# Altium project TableTennisX2.PrjPcb
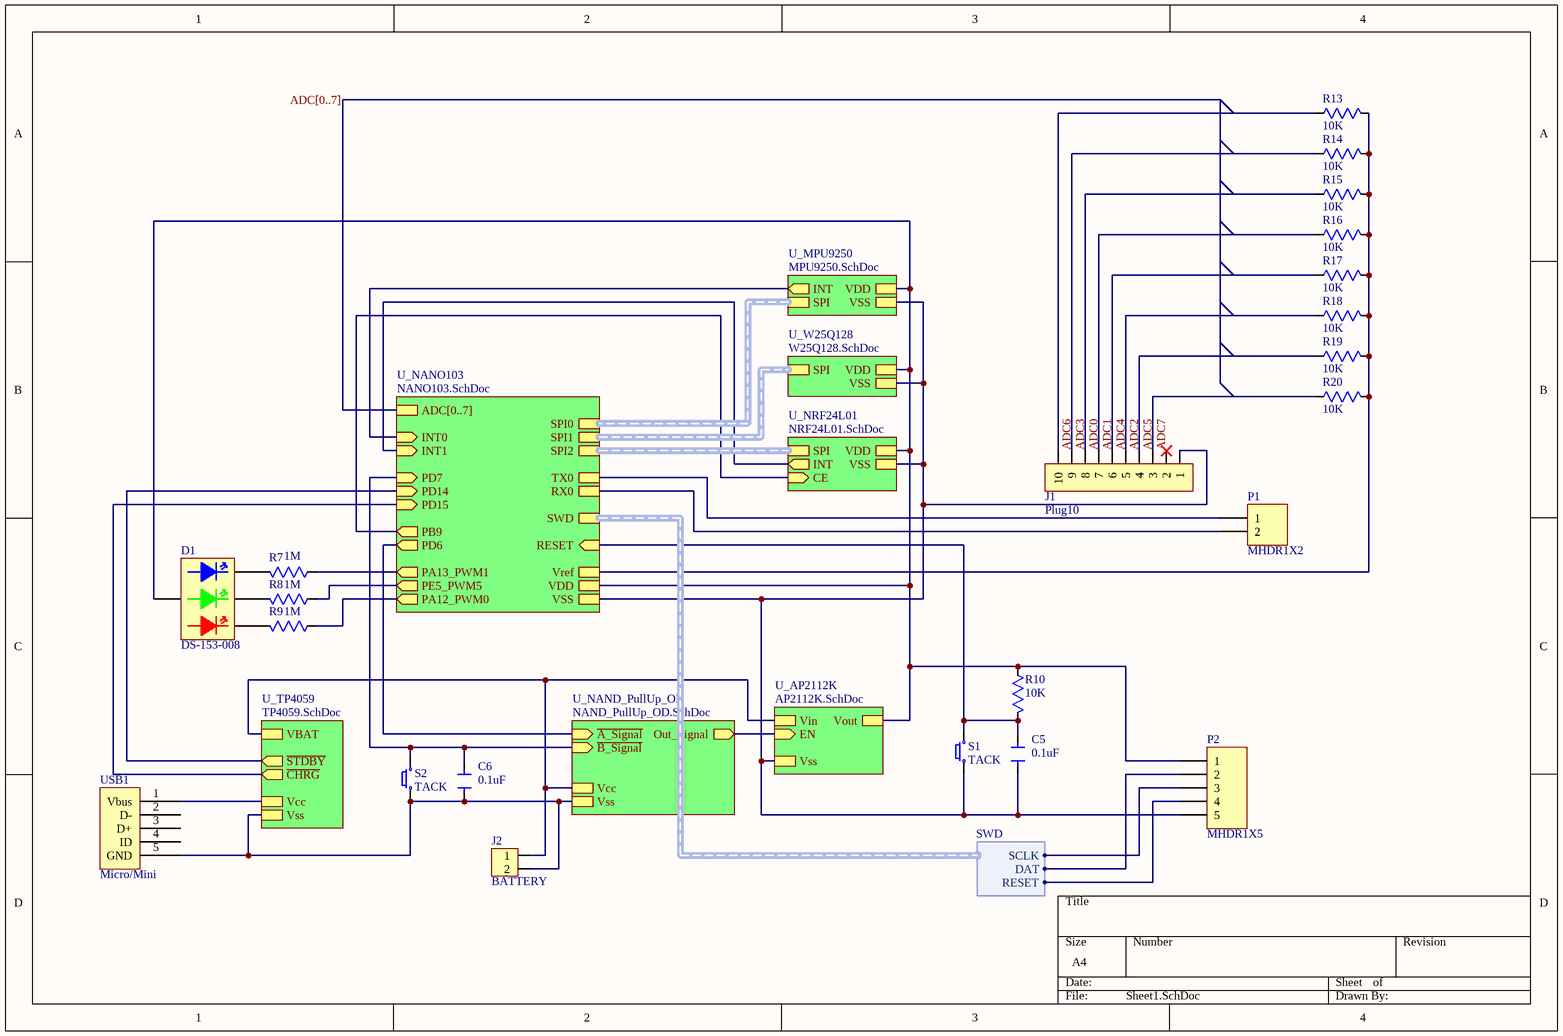
[diagram p0: Sheet1.SchDoc]
8 sheets, 62 parts. Net scope: hierarchical (ports join the sheet entries above them; power ports are global).
Sheets:
  Sheet1.SchDoc
    U_AP2112K = AP2112K.SchDoc
    U_NAND_PullUp_OD = NAND_PullUp_OD.SchDoc
    U_TP4059 = TP4059.SchDoc
    U_MPU9250 = MPU9250.SchDoc
    U_NANO103 = NANO103.SchDoc
    U_W25Q128 = W25Q128.SchDoc
    U_NRF24L01 = NRF24L01.SchDoc

## Sheet Sheet1.SchDoc
size A4

### Parts
C5  value 0.1uF  [CAP_0402]  (hidden comment: Cap)
C6  value 0.1uF  [CAP_0402]  (hidden comment: Cap)
D1  DS-153-008  [LED_RGB_0603]
J1  Plug10  [FPC0.5-10PS]
J2  BATTERY  [Terminal_block_2pin_1.25mm_SMD]
P1  MHDR1X2  [MHDR1X2]
P2  MHDR1X5  [MHDR1X5]
R7  value 1M  [RES_0402]  (hidden comment: Res)
R8  value 1M  [RES_0402]  (hidden comment: Res)
R9  value 1M  [RES_0402]  (hidden comment: Res)
R10  value 10K  [RES_0402]  (hidden comment: Res)
R13  value 10K  [RES_0402]  (hidden comment: Res)
R14  value 10K  [RES_0402]  (hidden comment: Res)
R15  value 10K  [RES_0402]  (hidden comment: Res)
R16  value 10K  [RES_0402]  (hidden comment: Res)
R17  value 10K  [RES_0402]  (hidden comment: Res)
R18  value 10K  [RES_0402]  (hidden comment: Res)
R19  value 10K  [RES_0402]  (hidden comment: Res)
R20  value 10K  [RES_0402]  (hidden comment: Res)
S1  TACK  [TACK-SW_SMD 2P 4x3mm_2]
S2  TACK  [TACK-SW_SMD 2P 4x3mm_2]
USB1  Micro/Mini  [USB_Micro-B_S_SMT]

### Sub-sheets
U_AP2112K = AP2112K.SchDoc: EN (in), Vin, Vout, Vss
U_MPU9250 = MPU9250.SchDoc: SPI (harness SPI), VDD, VSS, INT (out)
U_NAND_PullUp_OD = NAND_PullUp_OD.SchDoc: ~{A_Signal} (in), Out_Signal (out), ~{B_Signal} (in), Vcc, Vss
U_NANO103 = NANO103.SchDoc: ADC[0..7], SPI0 (harness SPI), SPI1 (harness SPI), SPI2 (harness SPI), INT0 (in), INT1 (in), PD15 (in), PD14 (in), PD7 (in), TX0, RX0, SWD (harness SWD), VDD, VSS, PB9 (out), PD6 (out), PA12_PWM0 (out), PA13_PWM1 (out), PE5_PWM5 (out), Vref, RESET (in)
U_NRF24L01 = NRF24L01.SchDoc: VDD, VSS, INT (out), CE (in), SPI (harness SPI)
U_TP4059 = TP4059.SchDoc: ~{CHRG} (out), ~{STDBY} (out), Vss, Vcc, VBAT
U_W25Q128 = W25Q128.SchDoc: SPI (harness SPI), VDD, VSS

### Harnesses
SWD: DAT, RESET, SCLK

### Nets
/RESET: C5.1 P2.4 R10.1 S1.1 ; sheet U_NANO103/RESET, sheet U_NANO103/SWD.RESET
ADC0: J1.8 R15.2
ADC1: J1.7 R16.2
ADC2: J1.5 R18.2
ADC3: J1.9 R14.2
ADC4: J1.6 R17.2
ADC5: J1.4 R19.2
ADC6: J1.10 R13.2
ADC7: J1.3 R20.2
CE: sheet U_NANO103/PB9, sheet U_NRF24L01/CE
ICE_CLK: P2.3 ; sheet U_NANO103/SWD.SCLK
ICE_DAT: P2.2 ; sheet U_NANO103/SWD.DAT
INT: sheet U_NANO103/INT1, sheet U_NRF24L01/INT
INT0: sheet U_MPU9250/INT, sheet U_NANO103/INT0
PA12_PWM0: R9.2 ; sheet U_NANO103/PA12_PWM0
PA13_PWM1: R7.2 ; sheet U_NANO103/PA13_PWM1
PD6: sheet U_NAND_PullUp_OD/~{A_Signal}, sheet U_NANO103/PD6
PD7: C6.1 S2.1 ; sheet U_NAND_PullUp_OD/~{B_Signal}, sheet U_NANO103/PD7
PD14: sheet U_TP4059/~{STDBY}, sheet U_NANO103/PD14
PD15: sheet U_TP4059/~{CHRG}, sheet U_NANO103/PD15
PE5_PWM5: R8.2 ; sheet U_NANO103/PE5_PWM5
RX0: P1.2 ; sheet U_NANO103/RX0
TX0: P1.1 ; sheet U_NANO103/TX0
V33: D1.3(Anode) P2.1 R10.2 ; sheet U_AP2112K/Vout, sheet U_MPU9250/VDD, sheet U_NANO103/VDD, sheet U_W25Q128/VDD, sheet U_NRF24L01/VDD
Vref: R13.1 R14.1 R15.1 R16.1 R17.1 R18.1 R19.1 R20.1 ; sheet U_NANO103/Vref
VSS: C5.2 J1.1 P2.5 S1.2 ; sheet U_AP2112K/Vss, sheet U_MPU9250/VSS, sheet U_NANO103/VSS, sheet U_W25Q128/VSS, sheet U_NRF24L01/VSS
NetC1_1: J2.1 ; sheet U_AP2112K/Vin, sheet U_NAND_PullUp_OD/Vcc, sheet U_TP4059/VBAT
NetC3_2: C6.2 J2.2 S2.2 USB1.5(GND) ; sheet U_NAND_PullUp_OD/Vss, sheet U_TP4059/Vss
NetD1_1: D1.1(G) R8.1
NetD1_2: D1.2(B) R7.1
NetD1_4: D1.4(R) R9.1
NetQ1_3: sheet U_AP2112K/EN, sheet U_NAND_PullUp_OD/Out_Signal
NetQ4_1: USB1.1(Vbus) ; sheet U_TP4059/Vcc

Not connected (* = marked no-connect by the designer): J1 2*; USB1 2(D-) 3(D+) 4(ID)

### Buses and harness runs
bus ADC[0..7] = sheet U_NANO103/ADC[0..7]
harness sheet U_MPU9250/SPI = sheet U_NANO103/SPI0
harness sheet U_NANO103/SPI1 = sheet U_W25Q128/SPI
harness sheet U_NANO103/SPI2 = sheet U_NRF24L01/SPI

### Library data of the parts
J2 = Plug2
P1 = MHDR1X2: Header, 2-Pin; LatestRevisionDate: 17-Jul-2002; LatestRevisionNote: Re-released for DXP Platform.; Publisher: Altium Limited
P2 = MHDR1X5: Header, 5-Pin; LatestRevisionDate: 17-Jul-2002; LatestRevisionNote: Re-released for DXP Platform.; Publisher: Altium Limited
S1 S2 = Switch_Button1
USB1 = USB2

## Sheet AP2112K.SchDoc
size A4
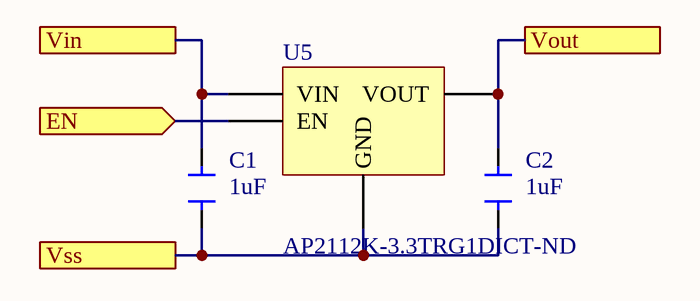
[diagram p1: AP2112K.SchDoc]

### Parts
C1  value 1uF  [CAP_0402]  (hidden comment: Cap)
C2  value 1uF  [CAP_0402]  (hidden comment: Cap)
U5  Supplier Part Number 1: AP2112K-3.3TRG1DICT-ND  [SOT23-5]  (hidden comment: AP2112K-3.3TRG1)

### Ports
EN (in), Vin, Vout, Vss

### Nets
V33: C2.1 U5.4(VOUT) ; port Vout
VSS: C1.2 C2.2 U5.3(GND) ; port Vss
NetC1_1: C1.1 U5.1(VIN) ; port Vin
NetQ1_3: U5.2(EN) ; port EN

### Library data of the parts
U5 = AP2112K-3.3TRG1: IC REG LINEAR 3.3V 600MA SOT23-5; pin to pad: 2>3 3>2 4>5; Manufacturer: Diodes; Number of Regulators: 1; Quiescent Current: 55uA; Polarity: Positive; Max Input Voltage: 6V; Min Input Voltage: 2.5V; Accuracy: 1.5%; Dropout Voltage: 250mV; Output Type: Fixed; Supplier 1: Digi-Key; Manufacturer Part Number: AP2112K-3.3TRG1; RoHS: Yes; Category: Voltage Regulators - Linear; Stock 1: 54786; Pricing 1: 1=0.47000, 10=0.35500, 25=0.32000, 100=0.17450, 250=0.16872, 500=0.15126, 1000=0.11636 (USD); Mount: Surface Mount; Case/Package: SOT-23-5; Number of Pins: 5; Min Operating Temperature: -40°C; Max Operating Temperature: 85°C; Output Current: 600mA; Max Output Current: 600mA; Output Voltage: 3.3V; Number of Outputs: 1; Package Quantity: 1; Packaging: Tape and Reel; Length: 3.1mm; Height: 1.3mm; Width: 1.7mm; Lead Free: Lead Free; ComponentLink1URL: https://datasheet.ciiva.com/29569/ap2112-29569919.pdf?src-supplier=Digi-Key; ComponentLink1Description: https://datasheet.ciiva.com/29569/ap2112-29569919.pdf?src-supplier=Digi-Key; ComponentLink2URL: https://datasheet.ciiva.com/30016/ap2112-30016792.pdf?src-supplier=Avnet; ComponentLink2Description: https://datasheet.ciiva.com/30016/ap2112-30016792.pdf?src-supplier=Avnet; ComponentLink3URL: https://datasheet.ciiva.com/29569/ap2112-29569917.pdf?src-supplier=Digi-Key; ComponentLink3Description: https://datasheet.ciiva.com/29569/ap2112-29569917.pdf?src-supplier=Digi-Key; ComponentLink4URL: https://datasheet.ciiva.com/29569/ap2112-29569918.pdf?src-supplier=Digi-Key; ComponentLink4Description: https://datasheet.ciiva.com/29569/ap2112-29569918.pdf?src-supplier=Digi-Key

## Sheet NAND_PullUp_OD.SchDoc
size A4
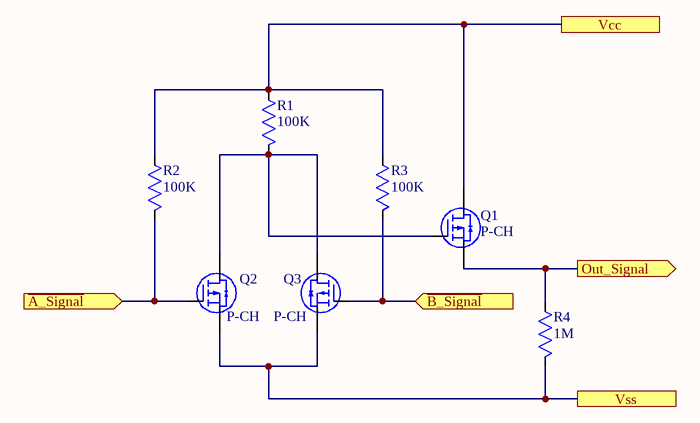
[diagram p2: NAND_PullUp_OD.SchDoc]

### Parts
Q1  Polarity: P-CH  [SOT-23]  (hidden comment: SI2301DS-T1)
Q2  Polarity: P-CH  [SOT-23]  (hidden comment: SI2301DS-T1)
Q3  Polarity: P-CH  [SOT-23]  (hidden comment: SI2301DS-T1)
R1  value 100K  [RES_0402]  (hidden comment: Res)
R2  value 100K  [RES_0402]  (hidden comment: Res)
R3  value 100K  [RES_0402]  (hidden comment: Res)
R4  value 1M  [RES_0402]  (hidden comment: Res)

### Ports
Out_Signal (out), Vcc, Vss, ~{A_Signal} (in), ~{B_Signal} (in)

### Nets
PD6: Q2.2 R2.1 ; port ~{A_Signal}
PD7: Q3.2 R3.1 ; port ~{B_Signal}
NetC1_1: Q1.1 R1.2 R2.2 R3.2 ; port Vcc
NetC3_2: Q2.3 Q3.3 R4.1 ; port Vss
NetQ1_2: Q1.2 Q2.1 Q3.1 R1.1
NetQ1_3: Q1.3 R4.2 ; port Out_Signal

### Library data of the parts
Q1-Q3 = SI2301DS-T1: Trans MOSFET P-CH 20V 2.3A 3-Pin TO-236 T/R; pin to pad: 1>2 2>1; Manufacturer: Vishay Siliconix; Rise Time: 36ns; Drain to Source Resistance: 130mR; Gate to Source Voltage (Vgs): 8V; Max Power Dissipation: 1.25W; Turn-Off Delay Time: 42ns; Turn-On Delay Time: 13ns; Number of Elements: 1; Element Configuration: Single; Drain to Source Voltage (Vdss): -20V; Supplier 1: Component Sense; Manufacturer Part Number: SI2301DS-T1; RoHS: No; Category: MOSFETs; Stock 1: 12531; Pricing 1: 143=0.17500, 500=0.15000, 1000=0.10000, 5000=0.09000, 10000=0.08000 (USD); Mount: Surface Mount; Case/Package: SOT-23-3; Number of Pins: 3; Weight: 0.050717oz; Min Operating Temperature: -55°C; Max Operating Temperature: 150°C; Packaging: Tape and Reel; Package Quantity: 3000; Continuous Drain Current (ID): 2.3A; Fall Time: 36ns; Power Dissipation: 1.25W; Number of Channels: 1; Length: 3.04mm; Height: 1.02mm; Width: 1.4mm; ComponentLink1URL: https://datasheet.ciiva.com/13048/70627-115154-13048148.pdf?src-supplier=Mouser; ComponentLink1Description: https://datasheet.ciiva.com/13048/70627-115154-13048148.pdf?src-supplier=Mouser; Supplier Part Number 1: SI2301DS-T1

## Sheet TP4059.SchDoc
size A4
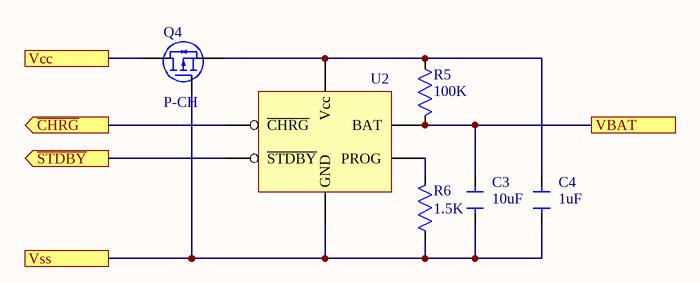
[diagram p3: TP4059.SchDoc]

### Parts
C3  value 10uF  [Cap_0603]  (hidden comment: Cap)
C4  value 1uF  [Cap_0603]  (hidden comment: Cap)
Q4  Polarity: P-CH  [SOT-23]  (hidden comment: SI2301DS-T1)
R5  value 100K  [RES_0402]  (hidden comment: Res)
R6  value 1.5K  [RES_0402]  (hidden comment: Res)
U2  TP4059  [SOT23-6]  (value not drawn)

### Ports
VBAT, Vcc, Vss, ~{CHRG} (out), ~{STDBY} (out)

### Nets
PD14: U2.3(~{STDBY}) ; port ~{STDBY}
PD15: U2.2(~{CHRG}) ; port ~{CHRG}
NetC1_1: C3.1 R5.1 U2.6(BAT) ; port VBAT
NetC3_2: C3.2 C4.2 Q4.2 R6.2 U2.4(GND) ; port Vss
NetC4_1: C4.1 Q4.3 R5.2 U2.1(Vcc)
NetQ4_1: Q4.1 ; port Vcc
NetR6_1: R6.1 U2.5(PROG)

### Library data of the parts
Q4 = SI2301DS-T1: Trans MOSFET P-CH 20V 2.3A 3-Pin TO-236 T/R; pin to pad: 1>2 2>1; Manufacturer: Vishay Siliconix; Rise Time: 36ns; Drain to Source Resistance: 130mR; Gate to Source Voltage (Vgs): 8V; Max Power Dissipation: 1.25W; Turn-Off Delay Time: 42ns; Turn-On Delay Time: 13ns; Number of Elements: 1; Element Configuration: Single; Drain to Source Voltage (Vdss): -20V; Supplier 1: Component Sense; Manufacturer Part Number: SI2301DS-T1; RoHS: No; Category: MOSFETs; Stock 1: 12531; Pricing 1: 143=0.17500, 500=0.15000, 1000=0.10000, 5000=0.09000, 10000=0.08000 (USD); Mount: Surface Mount; Case/Package: SOT-23-3; Number of Pins: 3; Weight: 0.050717oz; Min Operating Temperature: -55°C; Max Operating Temperature: 150°C; Packaging: Tape and Reel; Package Quantity: 3000; Continuous Drain Current (ID): 2.3A; Fall Time: 36ns; Power Dissipation: 1.25W; Number of Channels: 1; Length: 3.04mm; Height: 1.02mm; Width: 1.4mm; ComponentLink1URL: https://datasheet.ciiva.com/13048/70627-115154-13048148.pdf?src-supplier=Mouser; ComponentLink1Description: https://datasheet.ciiva.com/13048/70627-115154-13048148.pdf?src-supplier=Mouser; Supplier Part Number 1: SI2301DS-T1
U2 = TP4059: 600MA SOT23-6; pin to pad: 1>4 2>1 3>5 4>2 5>6 6>3; ComponentLink1Description: Datasheet; ComponentLink1URL: http://www.tp-asic.com/res/tp-asic/pdres/201403/TP4059.pdf

## Sheet MPU9250.SchDoc
size A4
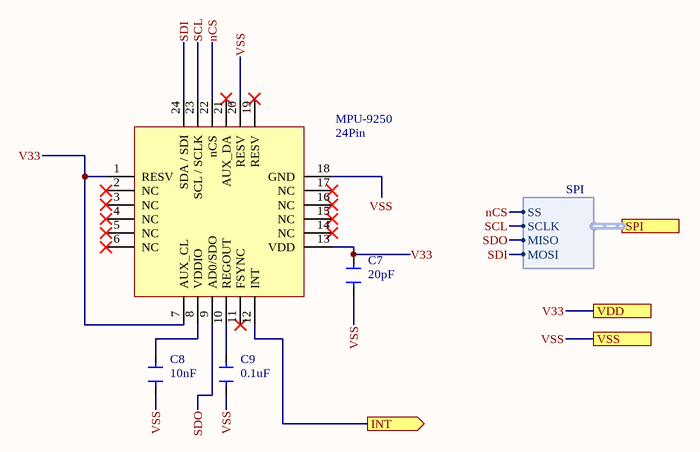
[diagram p4: MPU9250.SchDoc]

### Parts
C7  value 20pF  [CAP_0402]  (hidden comment: Cap)
C8  value 10nF  [CAP_0402]  (hidden comment: Cap)
C9  value 0.1uF  [CAP_0402]  (hidden comment: Cap)
MPU-9250  24Pin  [QFN_24PIN]

### Ports
INT (out), SPI (harness SPI), VDD, VSS

### Harnesses
SPI: SS, SCLK, MISO, MOSI

### Nets
INT0: MPU-9250.12(INT) ; port INT
nCS: MPU-9250.22(nCS) ; port SPI.SS
SCL: MPU-9250.23(SCL_/_SCLK) ; port SPI.SCLK
SDI: MPU-9250.24(SDA_/_SDI) ; port SPI.MOSI
SDO: MPU-9250.9(AD0/SDO) ; port SPI.MISO
V33: C7.1 MPU-9250.1(RESV) MPU-9250.7(AUX_CL) MPU-9250.13(VDD) ; port VDD
VSS: C7.2 C8.2 C9.2 MPU-9250.18(GND) MPU-9250.20(RESV) ; port VSS
NetC8_1: C8.1 MPU-9250.8(VDDIO)
NetC9_1: C9.1 MPU-9250.10(REGOUT)

Not connected (* = marked no-connect by the designer): MPU-9250 2(NC)* 3(NC)* 4(NC)* 5(NC)* 6(NC)* 11(FSYNC)* 14(NC)* 15(NC)* 16(NC)* 17(NC)* 19(RESV)* 21(AUX_DA)*

### Library data of the parts
MPU-9250 = MPU-9250_2

## Sheet NANO103.SchDoc
size A3
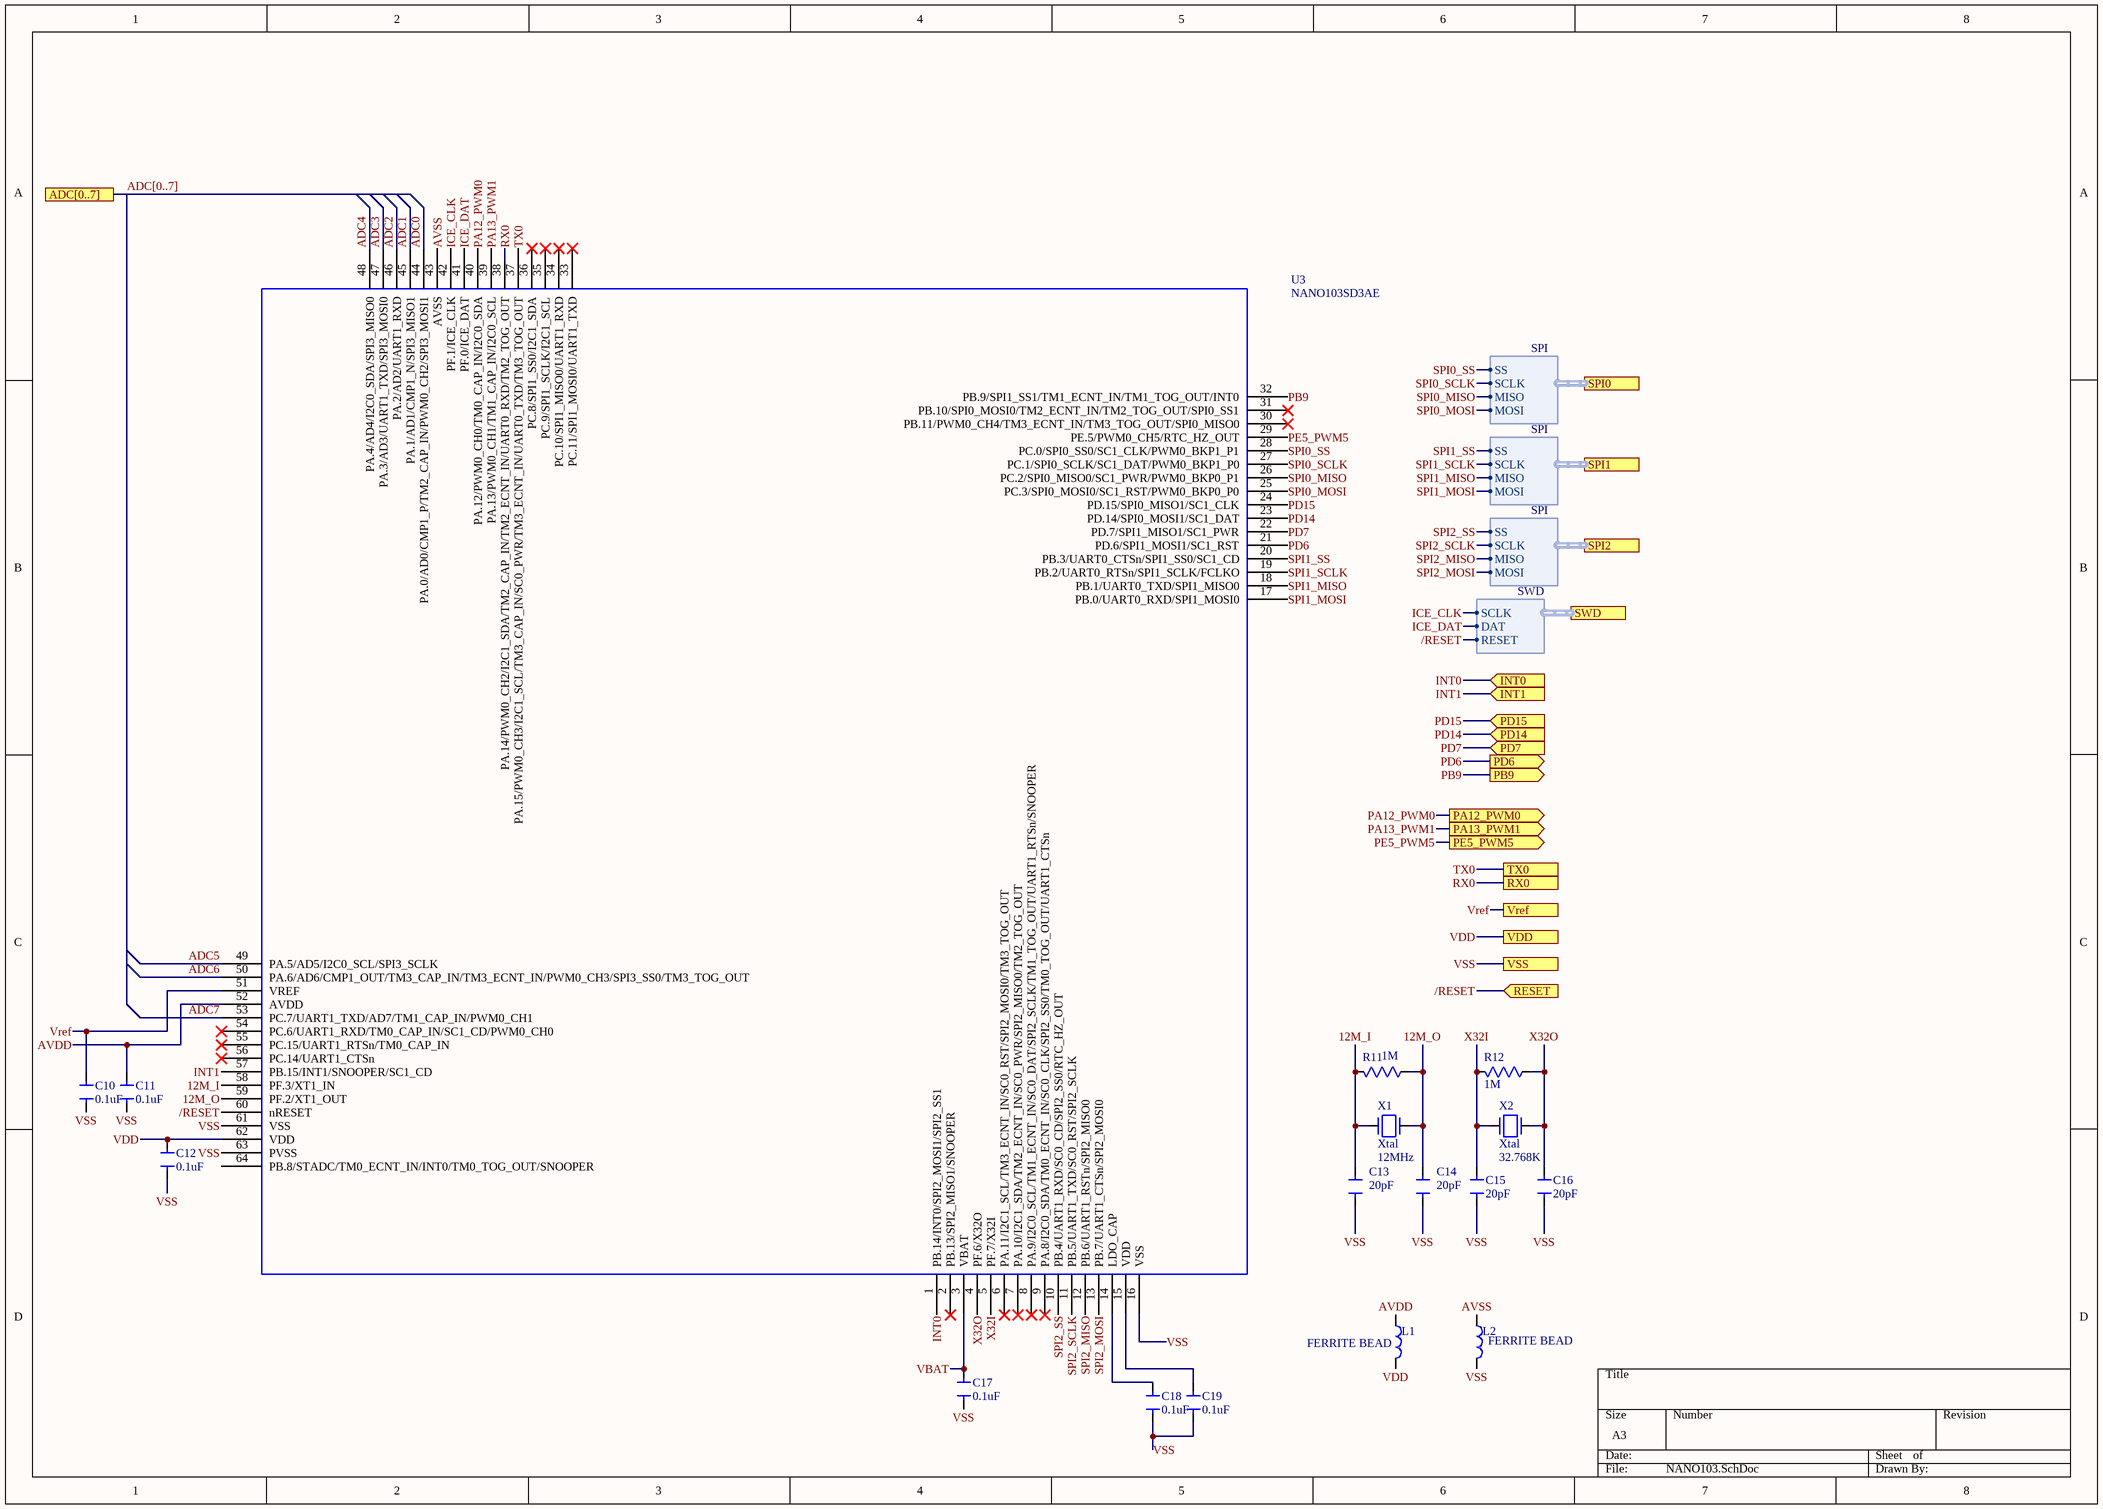
[diagram p5: NANO103.SchDoc]

### Parts
C10  value 0.1uF  [CAP_0402]  (hidden comment: Cap)
C11  value 0.1uF  [CAP_0402]  (hidden comment: Cap)
C12  value 0.1uF  [CAP_0402]  (hidden comment: Cap)
C13  value 20pF  [CAP_0402]  (hidden comment: Cap)
C14  value 20pF  [CAP_0402]  (hidden comment: Cap)
C15  value 20pF  [CAP_0402]  (hidden comment: Cap)
C16  value 20pF  [CAP_0402]  (hidden comment: Cap)
C17  value 0.1uF  [CAP_0402]  (hidden comment: Cap)
C18  value 0.1uF  [CAP_0402]  (hidden comment: Cap)
C19  value 0.1uF  [CAP_0402]  (hidden comment: Cap)
L1  FERRITE BEAD  [Inductor_0603]
L2  FERRITE BEAD  [Inductor_0603]
R11  value 1M  [RES_0402]  (hidden comment: Res)
R12  value 1M  [RES_0402]  (hidden comment: Res)
U3  NANO103SD3AE  [MCU_LQFP_64_7x7]
X1  Xtal  value 12MHz  [2520S]
X2  Xtal  value 32.768K  [FC-135]

### Ports
ADC[0..7], INT0 (in), INT1 (in), PA12_PWM0 (out), PA13_PWM1 (out), PB9 (out), PD6 (out), PD7 (in), PD14 (in), PD15 (in), PE5_PWM5 (out), RESET (in), RX0, SPI0 (harness SPI), SPI1 (harness SPI), SPI2 (harness SPI), SWD (harness SWD), TX0, VDD, Vref, VSS

### Harnesses
SPI: SS, MISO, MOSI, SCLK
SWD: DAT, RESET, SCLK

### Nets
12M_I: C13.1 R11.1 U3.58(PF.3/XT1_IN) X1.2
12M_O: C14.1 R11.2 U3.59(PF.2/XT1_OUT) X1.1
/RESET: U3.60(nRESET) ; port RESET, port SWD.RESET
ADC0: U3.44(PA.0/AD0/CMP1_P/TM2_CAP_IN/PWM0_CH2/SPI3_MOSI1)
ADC1: U3.45(PA.1/AD1/CMP1_N/SPI3_MISO1)
ADC2: U3.46(PA.2/AD2/UART1_RXD)
ADC3: U3.47(PA.3/AD3/UART1_TXD/SPI3_MOSI0)
ADC4: U3.48(PA.4/AD4/I2C0_SDA/SPI3_MISO0)
ADC5: U3.49(PA.5/AD5/I2C0_SCL/SPI3_SCLK)
ADC6: U3.50(PA.6/AD6/CMP1_OUT/TM3_CAP_IN/TM3_ECNT_IN/PWM0_CH3/SPI3_SS0/TM3_TOG_OUT)
ADC7: U3.53(PC.7/UART1_TXD/AD7/TM1_CAP_IN/PWM0_CH1)
AVDD: C11.2 L1.1 U3.52(AVDD)
AVSS: L2.1 U3.43(AVSS)
ICE_CLK: U3.42(PF.1/ICE_CLK) ; port SWD.SCLK
ICE_DAT: U3.41(PF.0/ICE_DAT) ; port SWD.DAT
INT0: U3.1(PB.14/INT0/SPI2_MOSI1/SPI2_SS1) ; port INT0
INT1: U3.57(PB.15/INT1/SNOOPER/SC1_CD) ; port INT1  [project net INT]
PA12_PWM0: U3.40(PA.12/PWM0_CH0/TM0_CAP_IN/I2C0_SDA) ; port PA12_PWM0
PA13_PWM1: U3.39(PA.13/PWM0_CH1/TM1_CAP_IN/I2C0_SCL) ; port PA13_PWM1
PB9: U3.32(PB.9/SPI1_SS1/TM1_ECNT_IN/TM1_TOG_OUT/INT0) ; port PB9  [project net CE]
PD6: U3.21(PD.6/SPI1_MOSI1/SC1_RST) ; port PD6
PD7: U3.22(PD.7/SPI1_MISO1/SC1_PWR) ; port PD7
PD14: U3.23(PD.14/SPI0_MOSI1/SC1_DAT) ; port PD14
PD15: U3.24(PD.15/SPI0_MISO1/SC1_CLK) ; port PD15
PE5_PWM5: U3.29(PE.5/PWM0_CH5/RTC_HZ_OUT) ; port PE5_PWM5
RX0: U3.38(PA.14/PWM0_CH2/I2C1_SDA/TM2_CAP_IN/TM2_ECNT_IN/UART0_RXD/TM2_TOG_OUT) ; port RX0
SPI0_MISO: U3.26(PC.2/SPI0_MISO0/SC1_PWR/PWM0_BKP0_P1) ; port SPI0.MISO  [project net SDO]
SPI0_MOSI: U3.25(PC.3/SPI0_MOSI0/SC1_RST/PWM0_BKP0_P0) ; port SPI0.MOSI  [project net SDI]
SPI0_SCLK: U3.27(PC.1/SPI0_SCLK/SC1_DAT/PWM0_BKP1_P0) ; port SPI0.SCLK  [project net SCL]
SPI0_SS: U3.28(PC.0/SPI0_SS0/SC1_CLK/PWM0_BKP1_P1) ; port SPI0.SS  [project net nCS]
SPI1_MISO: U3.18(PB.1/UART0_TXD/SPI1_MISO0) ; port SPI1.MISO
SPI1_MOSI: U3.17(PB.0/UART0_RXD/SPI1_MOSI0) ; port SPI1.MOSI
SPI1_SCLK: U3.19(PB.2/UART0_RTSn/SPI1_SCLK/FCLKO) ; port SPI1.SCLK
SPI1_SS: U3.20(PB.3/UART0_CTSn/SPI1_SS0/SC1_CD) ; port SPI1.SS
SPI2_MISO: U3.12(PB.6/UART1_RSTn/SPI2_MISO0) ; port SPI2.MISO
SPI2_MOSI: U3.13(PB.7/UART1_CTSn/SPI2_MOSI0) ; port SPI2.MOSI
SPI2_SCLK: U3.11(PB.5/UART1_TXD/SC0_RST/SPI2_SCLK) ; port SPI2.SCLK
SPI2_SS: U3.10(PB.4/UART1_RXD/SC0_CD/SPI2_SS0/RTC_HZ_OUT) ; port SPI2.SS
TX0: U3.37(PA.15/PWM0_CH3/I2C1_SCL/TM3_CAP_IN/SC0_PWR/TM3_ECNT_IN/UART0_TXD/TM3_TOG_OUT) ; port TX0
VBAT: C17.2 U3.3(VBAT)
VDD: C12.2 L1.2 U3.62(VDD) ; port VDD  [project net V33]
Vref: C10.2 U3.51(VREF) ; port Vref
VSS: C10.1 C11.1 C12.1 C13.2 C14.2 C15.2 C16.2 C17.1 C18.1 C19.1 L2.2 U3.16(VSS) U3.61(VSS) U3.63(PVSS) ; port VSS
X32I: C15.1 R12.1 U3.5(PF.7/X32I) X2.2
X32O: C16.1 R12.2 U3.4(PF.6/X32O) X2.1
NetC18_2: C18.2 U3.14(LDO_CAP)
NetC19_2: C19.2 U3.15(VDD)

Not connected (* = marked no-connect by the designer): U3 2(PB.13/SPI2_MISO1/SNOOPER)* 6(PA.11/I2C1_SCL/TM3_ECNT_IN/SC0_RST/SPI2_MOSI0/TM3_TOG_OUT)* 7(PA.10/I2C1_SDA/TM2_ECNT_IN/SC0_PWR/SPI2_MISO0/TM2_TOG_OUT)* 8(PA.9/I2C0_SCL/TM1_ECNT_IN/SC0_DAT/SPI2_SCLK/TM1_TOG_OUT/UART1_RTSn/SNOOPER)* 9(PA.8/I2C0_SDA/TM0_ECNT_IN/SC0_CLK/SPI2_SS0/TM0_TOG_OUT/UART1_CTSn)* 30(PB.11/PWM0_CH4/TM3_ECNT_IN/TM3_TOG_OUT/SPI0_MISO0)* 31(PB.10/SPI0_MOSI0/TM2_ECNT_IN/TM2_TOG_OUT/SPI0_SS1)* 33(PC.11/SPI1_MOSI0/UART1_TXD)* 34(PC.10/SPI1_MISO0/UART1_RXD)* 35(PC.9/SPI1_SCLK/I2C1_SCL)* 36(PC.8/SPI1_SS0/I2C1_SDA)* 54(PC.6/UART1_RXD/TM0_CAP_IN/SC1_CD/PWM0_CH0)* 55(PC.15/UART1_RTSn/TM0_CAP_IN)* 56(PC.14/UART1_CTSn)* 64(PB.8/STADC/TM0_ECNT_IN/INT0/TM0_TOG_OUT/SNOOPER)

### Buses and harness runs
bus ADC[0..7] = port ADC[0..7]

### Library data of the parts
L1 L2 = Inductor
U3 = NANO103SD3AE: OriginalSymbolOrigin: (0,0)

## Sheet W25Q128.SchDoc
size A4
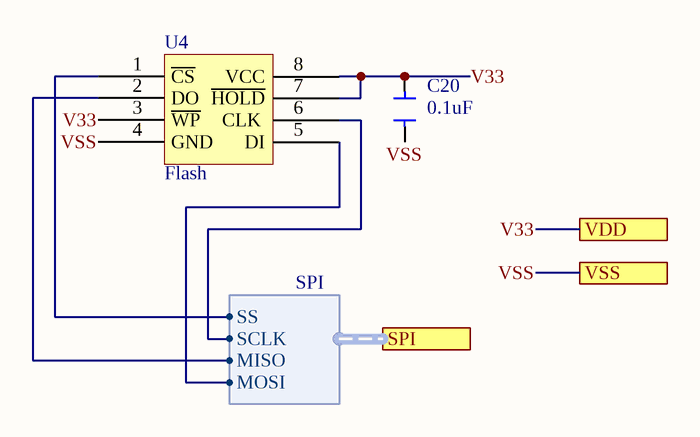
[diagram p6: W25Q128.SchDoc]

### Parts
C20  value 0.1uF  [CAP_0402]  (hidden comment: Cap)
U4  Flash  [8-Pin SOIC 208-mil]

### Ports
SPI (harness SPI), VDD, VSS

### Harnesses
SPI: SS, MISO, MOSI, SCLK

### Nets
SPI1_MISO: U4.2(DO) ; port SPI.MISO
SPI1_MOSI: U4.5(DI) ; port SPI.MOSI
SPI1_SCLK: U4.6(CLK) ; port SPI.SCLK
SPI1_SS: U4.1(~{CS}) ; port SPI.SS
V33: C20.1 U4.3(~{WP}) U4.7(~{HOLD}) U4.8(VCC) ; port VDD
VSS: C20.2 U4.4(GND) ; port VSS

### Library data of the parts
U4 = W25QXX

## Sheet NRF24L01.SchDoc
size A4
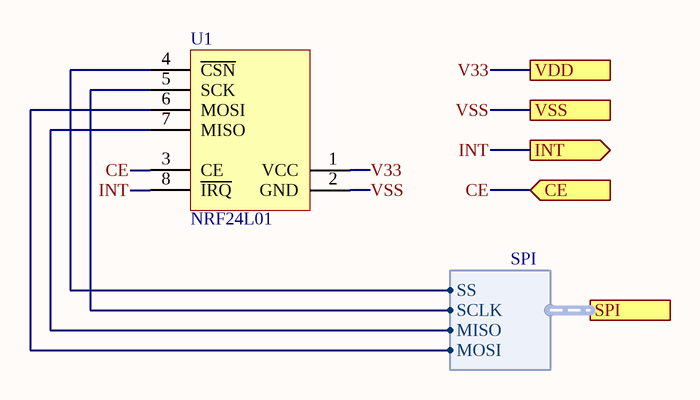
[diagram p7: NRF24L01.SchDoc]

### Parts
U1  NRF24L01  [NRF24L01P+PA+LNA+IPX]

### Ports
CE (in), INT (out), SPI (harness SPI), VDD, VSS

### Harnesses
SPI: SS, MISO, MOSI, SCLK

### Nets
CE: U1.3(CE) ; port CE
INT: U1.8(~{IRQ}) ; port INT
SPI2_MISO: U1.7(MISO) ; port SPI.MISO
SPI2_MOSI: U1.6(MOSI) ; port SPI.MOSI
SPI2_SCLK: U1.5(SCK) ; port SPI.SCLK
SPI2_SS: U1.4(~{CSN}) ; port SPI.SS
V33: U1.1(VCC) ; port VDD
VSS: U1.2(GND) ; port VSS

### Library data of the parts
U1 = NRF24L01_module: pin to pad: 2>8 3>2 4>3 5>4 6>5 7>6 8>7

## Nets that join several sheets
/RESET: Sheet1 (C5.1 P2.4 R10.1 S1.1), NANO103 (U3.60)
ADC0: Sheet1 (J1.8 R15.2), NANO103 (U3.44)
ADC1: Sheet1 (J1.7 R16.2), NANO103 (U3.45)
ADC2: Sheet1 (J1.5 R18.2), NANO103 (U3.46)
ADC3: Sheet1 (J1.9 R14.2), NANO103 (U3.47)
ADC4: Sheet1 (J1.6 R17.2), NANO103 (U3.48)
ADC5: Sheet1 (J1.4 R19.2), NANO103 (U3.49)
ADC6: Sheet1 (J1.10 R13.2), NANO103 (U3.50)
ADC7: Sheet1 (J1.3 R20.2), NANO103 (U3.53)
CE: NANO103 (U3.32), NRF24L01 (U1.3)
ICE_CLK: Sheet1 (P2.3), NANO103 (U3.42)
ICE_DAT: Sheet1 (P2.2), NANO103 (U3.41)
INT: NANO103 (U3.57), NRF24L01 (U1.8)
INT0: MPU9250 (MPU-9250.12), NANO103 (U3.1)
nCS: MPU9250 (MPU-9250.22), NANO103 (U3.28)
NetC1_1: Sheet1 (J2.1), AP2112K (C1.1 U5.1), NAND_PullUp_OD (Q1.1 R1.2 R2.2 R3.2), TP4059 (C3.1 R5.1 U2.6)
NetC3_2: Sheet1 (C6.2 J2.2 S2.2 USB1.5), NAND_PullUp_OD (Q2.3 Q3.3 R4.1), TP4059 (5 pins)
NetQ1_3: AP2112K (U5.2), NAND_PullUp_OD (Q1.3 R4.2)
NetQ4_1: Sheet1 (USB1.1), TP4059 (Q4.1)
PA12_PWM0: Sheet1 (R9.2), NANO103 (U3.40)
PA13_PWM1: Sheet1 (R7.2), NANO103 (U3.39)
PD6: NAND_PullUp_OD (Q2.2 R2.1), NANO103 (U3.21)
PD7: Sheet1 (C6.1 S2.1), NAND_PullUp_OD (Q3.2 R3.1), NANO103 (U3.22)
PD14: TP4059 (U2.3), NANO103 (U3.23)
PD15: TP4059 (U2.2), NANO103 (U3.24)
PE5_PWM5: Sheet1 (R8.2), NANO103 (U3.29)
RX0: Sheet1 (P1.2), NANO103 (U3.38)
SCL: MPU9250 (MPU-9250.23), NANO103 (U3.27)
SDI: MPU9250 (MPU-9250.24), NANO103 (U3.25)
SDO: MPU9250 (MPU-9250.9), NANO103 (U3.26)
SPI1_MISO: NANO103 (U3.18), W25Q128 (U4.2)
SPI1_MOSI: NANO103 (U3.17), W25Q128 (U4.5)
SPI1_SCLK: NANO103 (U3.19), W25Q128 (U4.6)
SPI1_SS: NANO103 (U3.20), W25Q128 (U4.1)
SPI2_MISO: NANO103 (U3.12), NRF24L01 (U1.7)
SPI2_MOSI: NANO103 (U3.13), NRF24L01 (U1.6)
SPI2_SCLK: NANO103 (U3.11), NRF24L01 (U1.5)
SPI2_SS: NANO103 (U3.10), NRF24L01 (U1.4)
TX0: Sheet1 (P1.1), NANO103 (U3.37)
V33: Sheet1 (D1.3 P2.1 R10.2), AP2112K (C2.1 U5.4), MPU9250 (C7.1 MPU-9250.1 MPU-9250.7 MPU-9250.13), NANO103 (C12.2 L1.2 U3.62), W25Q128 (C20.1 U4.3 U4.7 U4.8), NRF24L01 (U1.1)
Vref: Sheet1 (8 pins), NANO103 (C10.2 U3.51)
VSS: Sheet1 (C5.2 J1.1 P2.5 S1.2), AP2112K (C1.2 C2.2 U5.3), MPU9250 (5 pins), NANO103 (14 pins), W25Q128 (C20.2 U4.4), NRF24L01 (U1.2)